# EAGLE schematic PICkit Adapter (EAGLE 6.3)
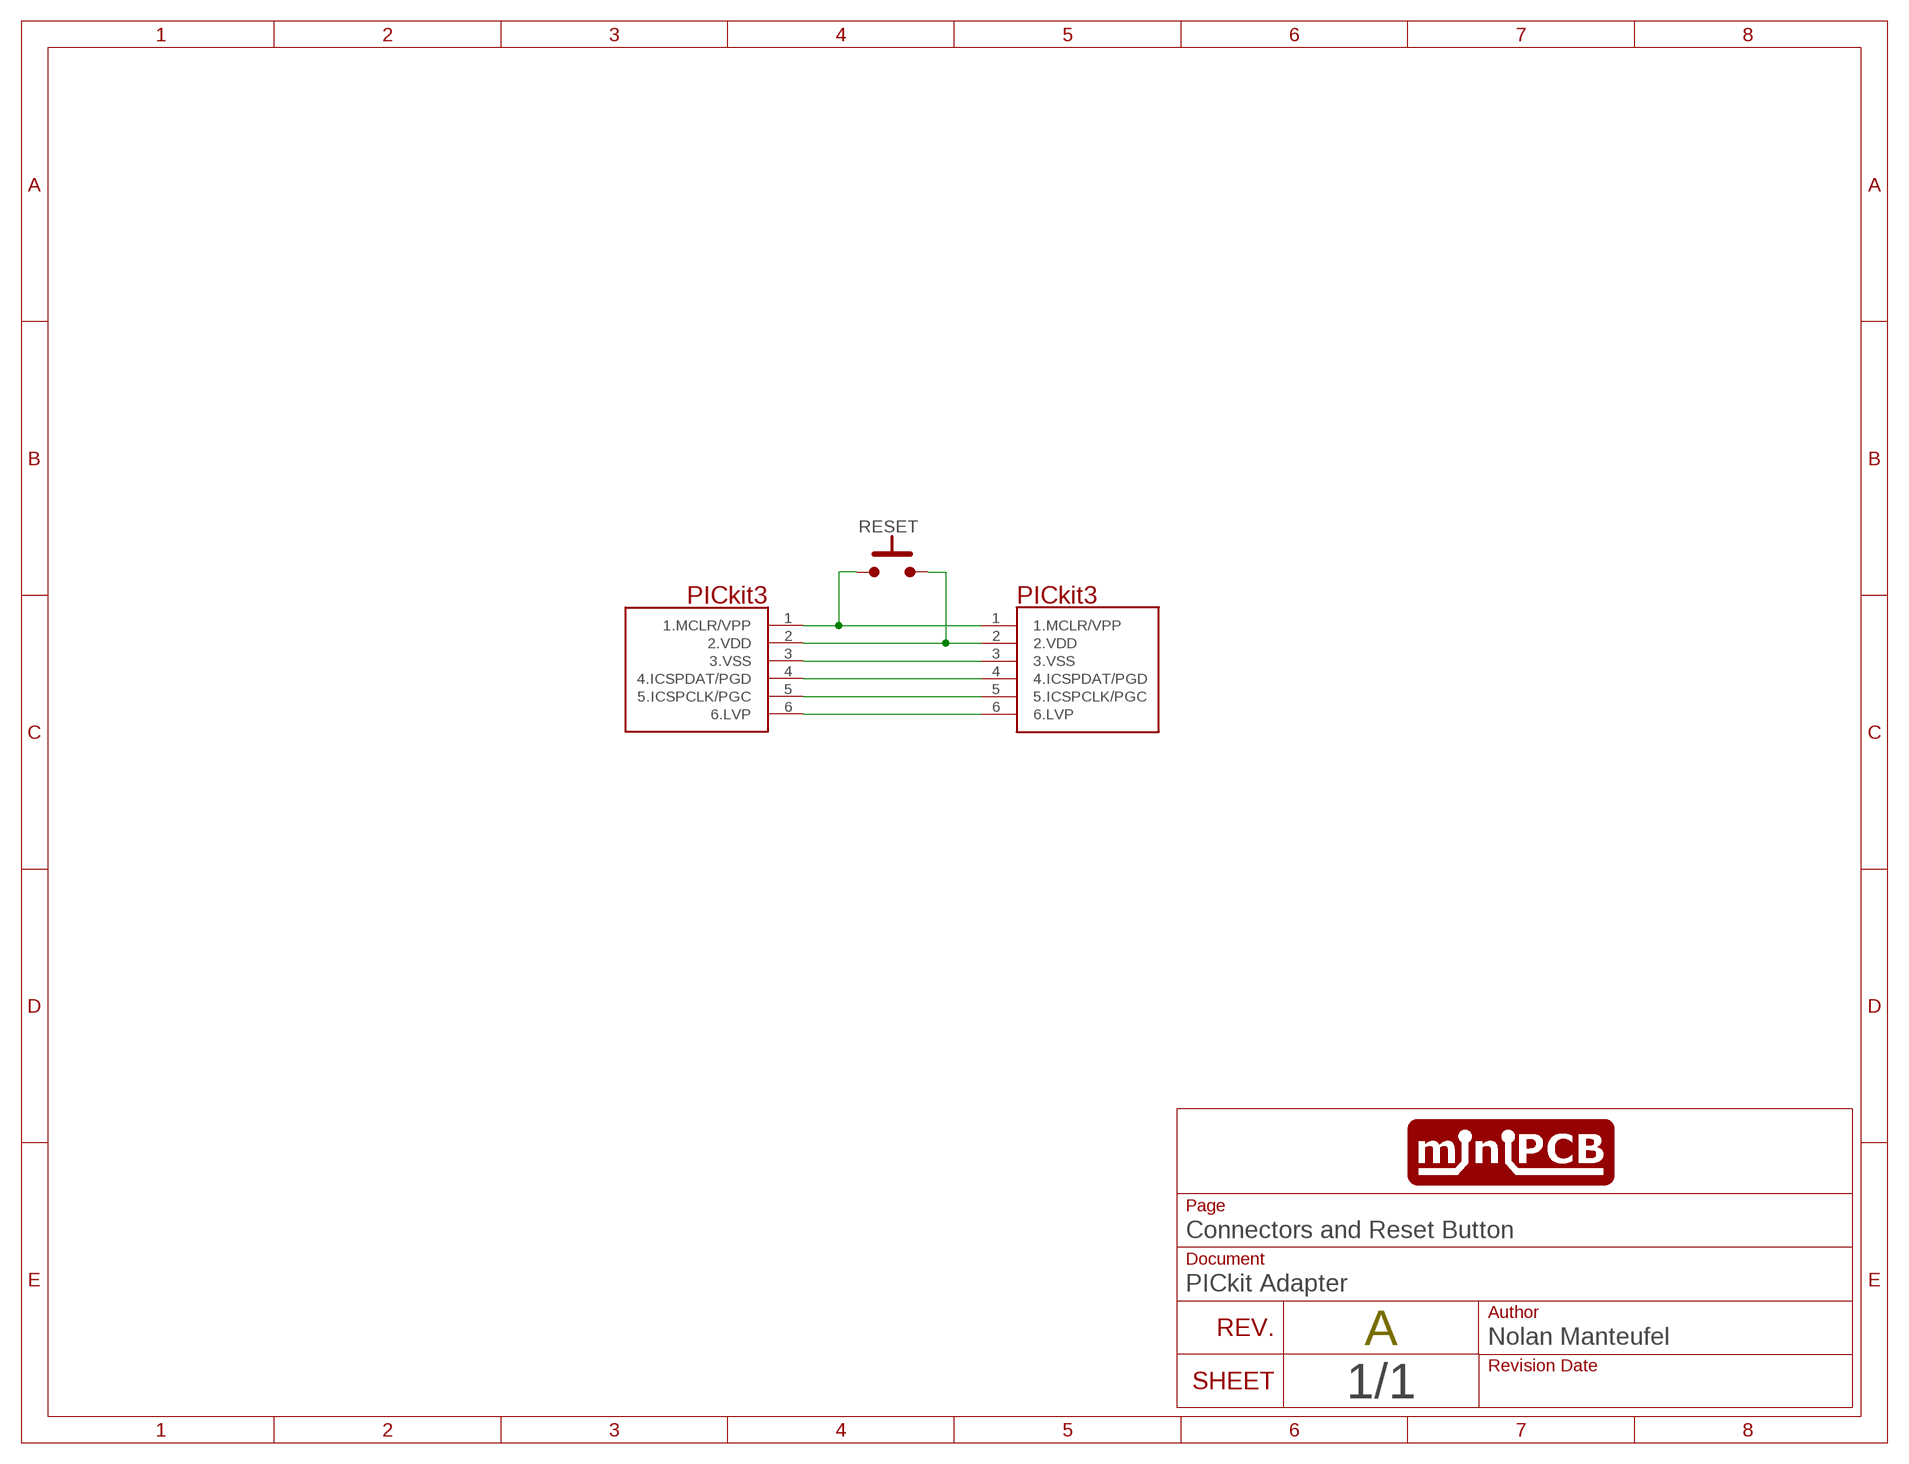
[diagram p0: schematic, sheet 1]

## Parts
RESET  PUSHBUTTON3X6MM  [3X6MM]
U$2  PICKIT3/1.27  [PINS_6_1MM27]
U$3  PICKIT  PICKIT3TEXT  [PINS_6_PICKIT3_TEXT]

## Nets
N$1: RESET.1 U$2.1(1.MCLR/VPP) U$3.1(1.MCLR/VPP)
N$2: RESET.2 U$2.2(2.VDD) U$3.2(2.VDD)
N$3: U$2.3(3.VSS) U$3.3(3.VSS)
N$4: U$2.4(4.ICSPDAT/PGD) U$3.4(4.ICSPDAT/PGD)
N$5: U$2.5(5.ICSPCLK/PGC) U$3.5(5.ICSPCLK/PGC)
N$6: U$2.6(6.LVP) U$3.6(6.LVP)

## Library data of the parts
RESET = nolan-utsa:PUSHBUTTON: Tactile push button switch
U$2 U$3 = nolan-utsa:PICKIT3